# Altium schematic sheet Driver.SchDoc
size A4
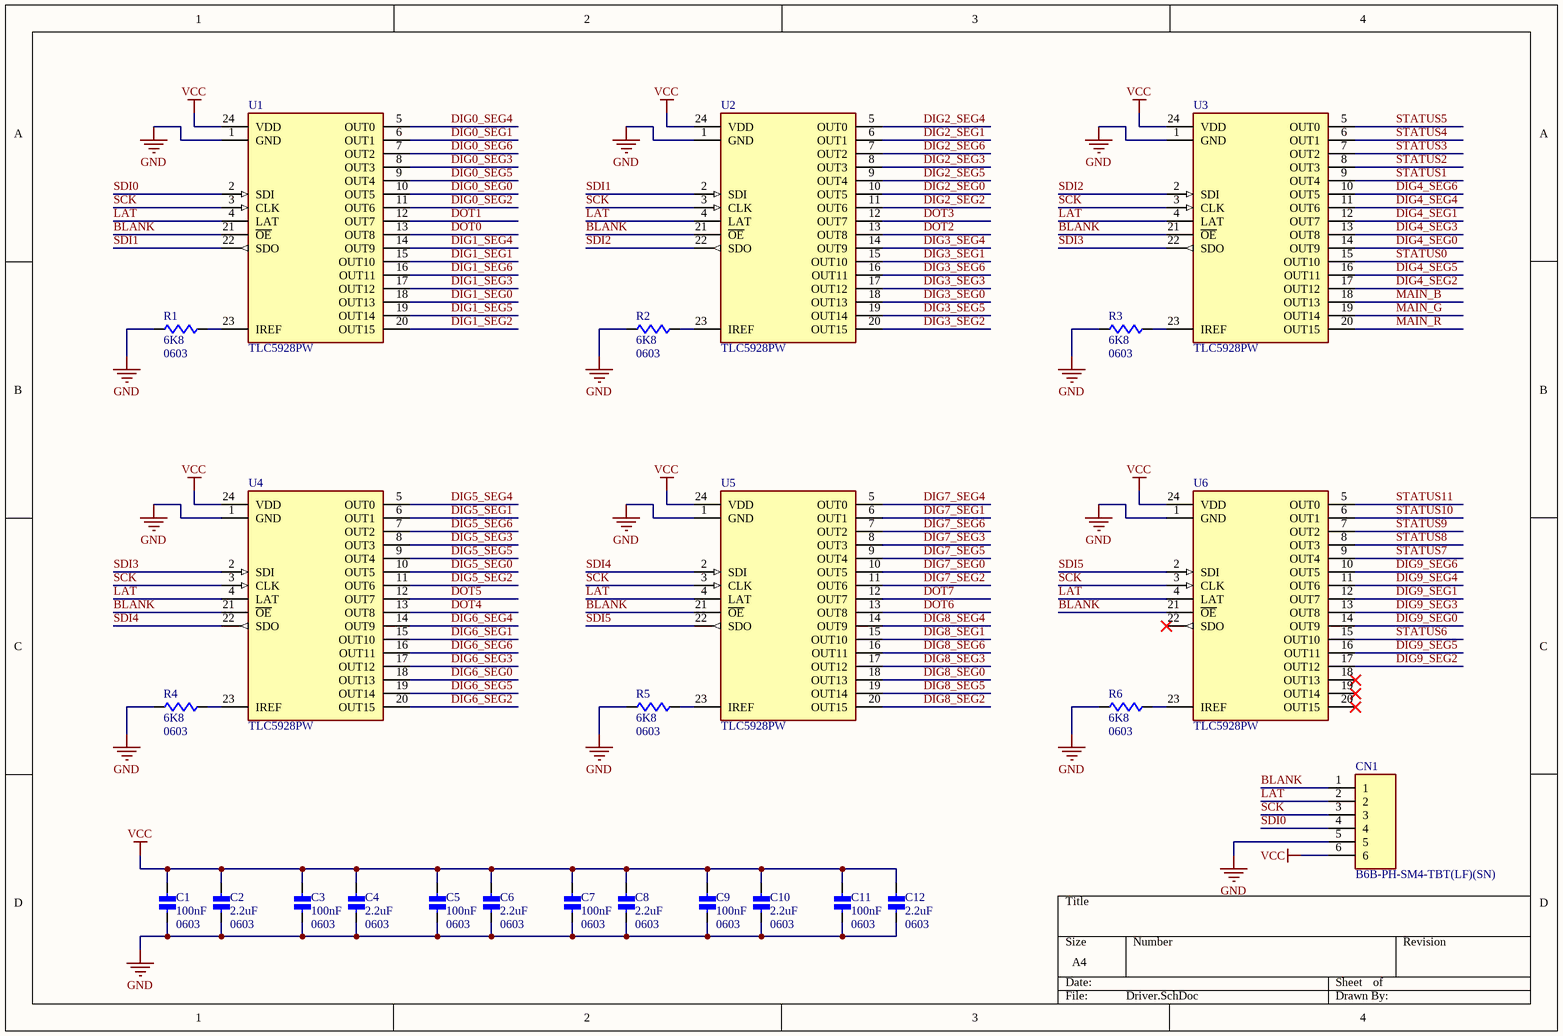
[diagram p0: Driver.SchDoc]

## Parts
C1  100nF  Package: 0603  [CAPC0603X08N]
C2  2.2uF  Package: 0603  [CAPC0603X08N]
C3  100nF  Package: 0603  [CAPC0603X08N]
C4  2.2uF  Package: 0603  [CAPC0603X08N]
C5  100nF  Package: 0603  [CAPC0603X08N]
C6  2.2uF  Package: 0603  [CAPC0603X08N]
C7  100nF  Package: 0603  [CAPC0603X08N]
C8  2.2uF  Package: 0603  [CAPC0603X08N]
C9  100nF  Package: 0603  [CAPC0603X08N]
C10  2.2uF  Package: 0603  [CAPC0603X08N]
C11  100nF  Package: 0603  [CAPC0603X08N]
C12  2.2uF  Package: 0603  [CAPC0603X08N]
CN1  B6B-PH-SM4-TBT(LF)(SN)  [B6B-PH-SM4-TBT(LF)(SN)]
R1  6K8  Package: 0603  [RESC0603X04N]
R2  6K8  Package: 0603  [RESC0603X04N]
R3  6K8  Package: 0603  [RESC0603X04N]
R4  6K8  Package: 0603  [RESC0603X04N]
R5  6K8  Package: 0603  [RESC0603X04N]
R6  6K8  Package: 0603  [RESC0603X04N]
U1  TLC5928PW  [TSOP65P640X120-24N]
U2  TLC5928PW  [TSOP65P640X120-24N]
U3  TLC5928PW  [TSOP65P640X120-24N]
U4  TLC5928PW  [TSOP65P640X120-24N]
U5  TLC5928PW  [TSOP65P640X120-24N]
U6  TLC5928PW  [TSOP65P640X120-24N]

## Nets
GND: C1.2 C2.2 C3.2 C4.2 C5.2 C6.2 C7.2 C8.2 C9.2 C10.2 C11.2 C12.2 CN1.5 R1.2 R2.2 R3.2 R4.2 R5.2 R6.2 U1.1(GND) U2.1(GND) U3.1(GND) U4.1(GND) U5.1(GND) U6.1(GND)
VCC: C1.1 C2.1 C3.1 C4.1 C5.1 C6.1 C7.1 C8.1 C9.1 C10.1 C11.1 C12.1 CN1.6 U1.24(VDD) U2.24(VDD) U3.24(VDD) U4.24(VDD) U5.24(VDD) U6.24(VDD)
BLANK: CN1.1 U1.21(~{OE}) U2.21(~{OE}) U3.21(~{OE}) U4.21(~{OE}) U5.21(~{OE}) U6.21(~{OE})
DIG0_SEG0: U1.10(OUT5)
DIG0_SEG1: U1.6(OUT1)
DIG0_SEG2: U1.11(OUT6)
DIG0_SEG3: U1.8(OUT3)
DIG0_SEG4: U1.5(OUT0)
DIG0_SEG5: U1.9(OUT4)
DIG0_SEG6: U1.7(OUT2)
DIG1_SEG0: U1.18(OUT13)
DIG1_SEG1: U1.15(OUT10)
DIG1_SEG2: U1.20(OUT15)
DIG1_SEG3: U1.17(OUT12)
DIG1_SEG4: U1.14(OUT9)
DIG1_SEG5: U1.19(OUT14)
DIG1_SEG6: U1.16(OUT11)
DIG2_SEG0: U2.10(OUT5)
DIG2_SEG1: U2.6(OUT1)
DIG2_SEG2: U2.11(OUT6)
DIG2_SEG3: U2.8(OUT3)
DIG2_SEG4: U2.5(OUT0)
DIG2_SEG5: U2.9(OUT4)
DIG2_SEG6: U2.7(OUT2)
DIG3_SEG0: U2.18(OUT13)
DIG3_SEG1: U2.15(OUT10)
DIG3_SEG2: U2.20(OUT15)
DIG3_SEG3: U2.17(OUT12)
DIG3_SEG4: U2.14(OUT9)
DIG3_SEG5: U2.19(OUT14)
DIG3_SEG6: U2.16(OUT11)
DIG4_SEG0: U3.14(OUT9)
DIG4_SEG1: U3.12(OUT7)
DIG4_SEG2: U3.17(OUT12)
DIG4_SEG3: U3.13(OUT8)
DIG4_SEG4: U3.11(OUT6)
DIG4_SEG5: U3.16(OUT11)
DIG4_SEG6: U3.10(OUT5)
DIG5_SEG0: U4.10(OUT5)
DIG5_SEG1: U4.6(OUT1)
DIG5_SEG2: U4.11(OUT6)
DIG5_SEG3: U4.8(OUT3)
DIG5_SEG4: U4.5(OUT0)
DIG5_SEG5: U4.9(OUT4)
DIG5_SEG6: U4.7(OUT2)
DIG6_SEG0: U4.18(OUT13)
DIG6_SEG1: U4.15(OUT10)
DIG6_SEG2: U4.20(OUT15)
DIG6_SEG3: U4.17(OUT12)
DIG6_SEG4: U4.14(OUT9)
DIG6_SEG5: U4.19(OUT14)
DIG6_SEG6: U4.16(OUT11)
DIG7_SEG0: U5.10(OUT5)
DIG7_SEG1: U5.6(OUT1)
DIG7_SEG2: U5.11(OUT6)
DIG7_SEG3: U5.8(OUT3)
DIG7_SEG4: U5.5(OUT0)
DIG7_SEG5: U5.9(OUT4)
DIG7_SEG6: U5.7(OUT2)
DIG8_SEG0: U5.18(OUT13)
DIG8_SEG1: U5.15(OUT10)
DIG8_SEG2: U5.20(OUT15)
DIG8_SEG3: U5.17(OUT12)
DIG8_SEG4: U5.14(OUT9)
DIG8_SEG5: U5.19(OUT14)
DIG8_SEG6: U5.16(OUT11)
DIG9_SEG0: U6.14(OUT9)
DIG9_SEG1: U6.12(OUT7)
DIG9_SEG2: U6.17(OUT12)
DIG9_SEG3: U6.13(OUT8)
DIG9_SEG4: U6.11(OUT6)
DIG9_SEG5: U6.16(OUT11)
DIG9_SEG6: U6.10(OUT5)
DOT0: U1.13(OUT8)
DOT1: U1.12(OUT7)
DOT2: U2.13(OUT8)
DOT3: U2.12(OUT7)
DOT4: U4.13(OUT8)
DOT5: U4.12(OUT7)
DOT6: U5.13(OUT8)
DOT7: U5.12(OUT7)
LAT: CN1.2 U1.4(LAT) U2.4(LAT) U3.4(LAT) U4.4(LAT) U5.4(LAT) U6.4(LAT)
MAIN_B: U3.18(OUT13)
MAIN_G: U3.19(OUT14)
MAIN_R: U3.20(OUT15)
SCK: CN1.3 U1.3(CLK) U2.3(CLK) U3.3(CLK) U4.3(CLK) U5.3(CLK) U6.3(CLK)
SDI0: CN1.4 U1.2(SDI)
SDI1: U1.22(SDO) U2.2(SDI)
SDI2: U2.22(SDO) U3.2(SDI)
SDI3: U3.22(SDO) U4.2(SDI)
SDI4: U4.22(SDO) U5.2(SDI)
SDI5: U5.22(SDO) U6.2(SDI)
STATUS0: U3.15(OUT10)
STATUS1: U3.9(OUT4)
STATUS2: U3.8(OUT3)
STATUS3: U3.7(OUT2)
STATUS4: U3.6(OUT1)
STATUS5: U3.5(OUT0)
STATUS6: U6.15(OUT10)
STATUS7: U6.9(OUT4)
STATUS8: U6.8(OUT3)
STATUS9: U6.7(OUT2)
STATUS10: U6.6(OUT1)
STATUS11: U6.5(OUT0)
NetR1_1: R1.1 U1.23(IREF)
NetR2_1: R2.1 U2.23(IREF)
NetR3_1: R3.1 U3.23(IREF)
NetR4_1: R4.1 U4.23(IREF)
NetR5_1: R5.1 U5.23(IREF)
NetR6_1: R6.1 U6.23(IREF)

Not connected (* = marked no-connect by the designer): U6 18(OUT13)* 19(OUT14)* 20(OUT15)* 22(SDO)*

## Library data of the parts
C1-C12 = GENERIC CAPC 0603: Generic 0603 Capacitors; Manufacturer: -; Manufacturer Part Number: -; Supplier 1: Digi-Key; Supplier Part Number 1: -; Supplier 2: LCSC; Supplier Part Number 2: -; Categories: Capacitors; Voltage - Rated: -; Temperature Coefficient: -; Tolerance: -
  C1 C3 C5 C7 C9 C11: Capacitance: 100nF
  C2 C4 C6 C8 C10 C12: Capacitance: 2.2uF
CN1 = B6B-PH-SM4-TBT(LF)(SN): Connector Header Surface Mount 6 position 0.079" (2.00mm)
R1-R6 = GENERIC RESC 0603: Generic 0603 1%/5% Resistor; Categories: Resistors; Manufacturer: -; Manufacturer Part Number: -; Supplier 1: Digi-Key; Supplier Part Number 1: -; Supplier 2: LCSC; Supplier Part Number 2: -; Temperature Coefficient: -; Tolerance: -; Power (Watts): -; Resistance: 6K8
U1-U6 = TLC5928PW: LED Driver IC 16 Output Linear Shift Register  Dimming 35mA 24-TSSOP; Manufacturer: Texas Instruments; Categories: LED Drivers; Manufacturer Part Number: TLC5928PW; Package: 24-TSSOP; Supplier 1: Digi-Key; Supplier 2: LCSC; Supplier Part Number 1: 296-23819-5-ND; Supplier Part Number 2: C1554293